# Altium schematic sheet AMS_Slave_Controller.SchDoc: Sheetname
size A4; Date: 05.10.2017; CheckedBy: UNCHECKED; Author: Team Member; Organization: Baltic Racing; Address1: Zur Schwedenschanze 15; Address2: Haus 18; Address3: 18435 Stralsund; Revision: xx.xx; SheetNumber: 1; SheetTotal: 3; Rules: TODO; ProjectName: Projekt
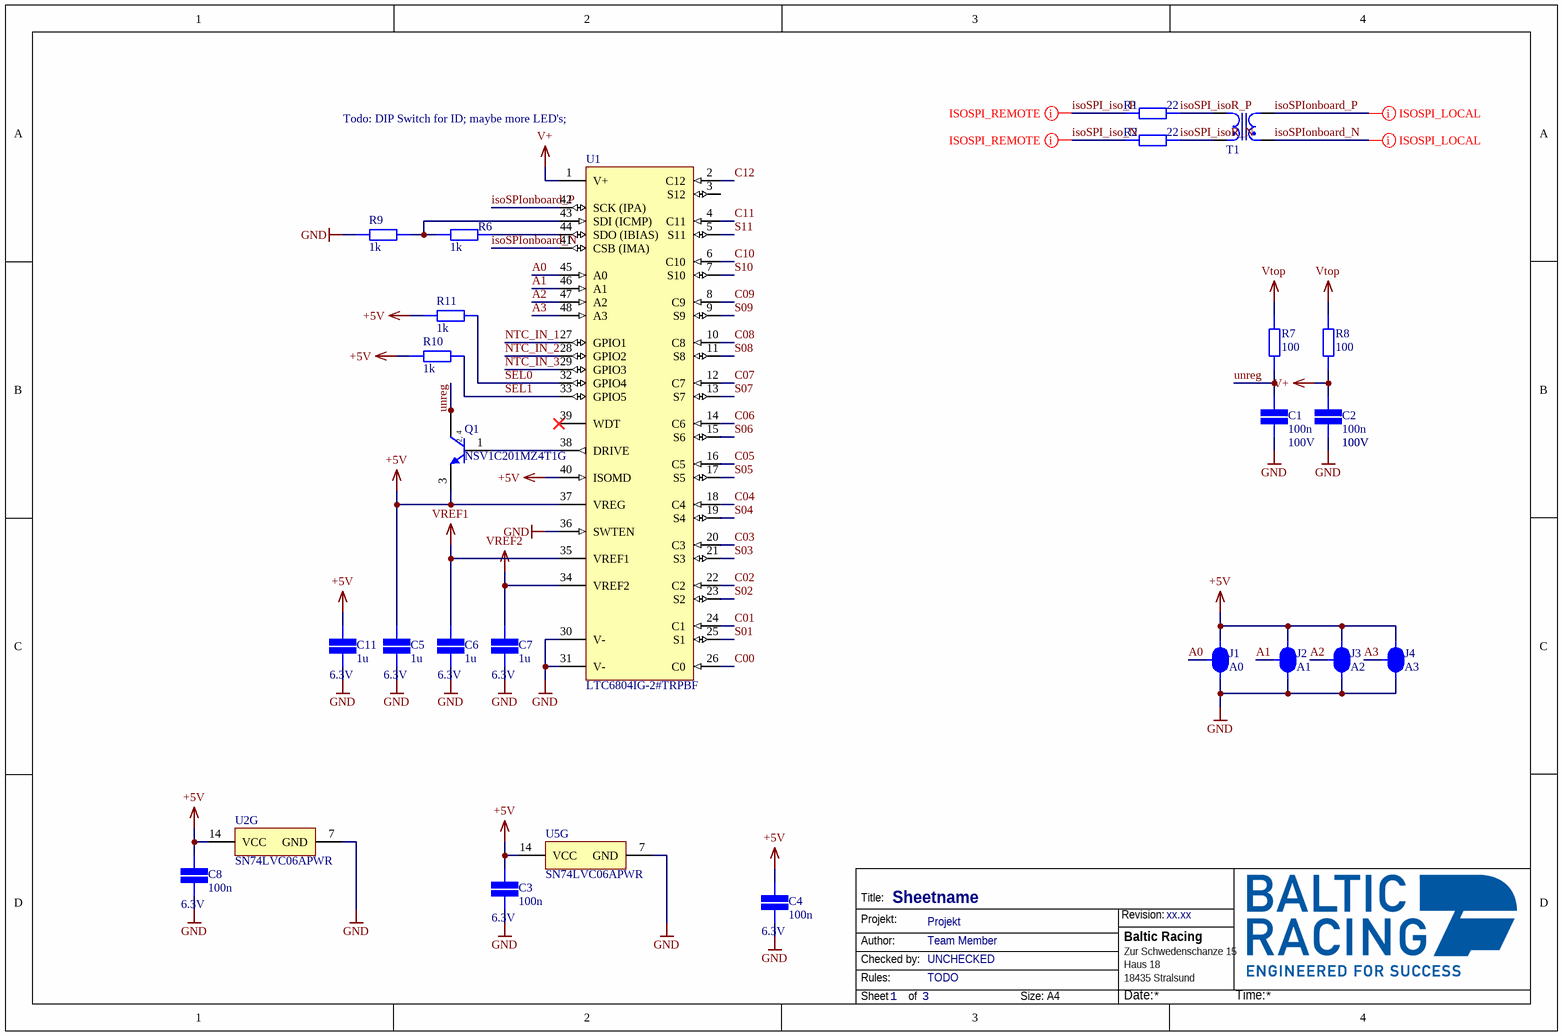
[diagram p0: AMS_Slave_Controller.SchDoc]

## Parts
C1  value 100n  Voltage: 100V  [CAP 0805/2012]  (hidden comment: SMD Capacitor)
C2  value 100n  Voltage: 100V  [CAP 0805/2012]  (hidden comment: SMD Capacitor)
C3  value 100n  Voltage: 6.3V  [CAP 0603/1608]  (hidden comment: SMD Capacitor)
C4  value 100n  Voltage: 6.3V  [CAP 0603/1608]  (hidden comment: SMD Capacitor)
C5  value 1u  Voltage: 6.3V  [CAP 0805/2012]  (hidden comment: SMD Capacitor)
C6  value 1u  Voltage: 6.3V  [CAP 0805/2012]  (hidden comment: SMD Capacitor)
C7  value 1u  Voltage: 6.3V  [CAP 0805/2012]  (hidden comment: SMD Capacitor)
C8  value 100n  Voltage: 6.3V  [CAP 0603/1608]  (hidden comment: SMD Capacitor)
C11  value 1u  Voltage: 6.3V  [CAP 0805/2012]  (hidden comment: SMD Capacitor)
J1  A0  [SMD-JUMPER-3]
J2  A1  [SMD-JUMPER-3]
J3  A2  [SMD-JUMPER-3]
J4  A3  [SMD-JUMPER-3]
Q1  NSV1C201MZ4T1G  [ONSC-SOT-223-4-318E-04_V]
R1  value 22  [STACKPOLE CSR0603]  (hidden comment: SMD Resistor)
R2  value 22  [STACKPOLE CSR0603]  (hidden comment: SMD Resistor)
R6  value 1k  [STACKPOLE CSR0603]  (hidden comment: SMD Resistor)
R7  value 100  [STACKPOLE CSR0603]  (hidden comment: SMD Resistor)
R8  value 100  [STACKPOLE CSR0603]  (hidden comment: SMD Resistor)
R9  value 1k  [STACKPOLE CSR0603]  (hidden comment: SMD Resistor)
R10  value 1k  [STACKPOLE CSR0603]  (hidden comment: SMD Resistor)
R11  value 1k  [STACKPOLE CSR0603]  (hidden comment: SMD Resistor)
T1  750110055  [Wuerth_750110055]  (value not drawn)
U1  LTC6804IG-2#TRPBF  [LT-G-48_M]
U2  SN74LVC06APWR  [PW0014A_M]  (part G of 7)
U5  SN74LVC06APWR  [PW0014A_M]  (part G of 7)

## Nets
+5V: C3.2 C4.2 C5.1 C8.2 C11.1 J1.3 J2.3 J3.3 J4.3 Q1.3(E) R10.1 R11.1 U1.37(VREG) U1.40(ISOMD) U2.14(VCC) U5.14(VCC)
GND: C1.1 C2.1 C3.1 C4.1 C5.2 C6.2 C7.2 C8.1 C11.2 J1.1 J2.1 J3.1 J4.1 R9.2 U1.30(V-) U1.31(V-) U1.36(SWTEN) U2.7(GND) U5.7(GND)
V+: C2.2 R8.1 U1.1(V+)
VREF1: C6.1 U1.35(VREF1)
VREF2: C7.1 U1.34(VREF2)
Vtop: R7.2 R8.2
A0: J1.2 U1.45(A0)
A1: J2.2 U1.46(A1)
A2: J3.2 U1.47(A2)
A3: J4.2 U1.48(A3)
C00: U1.26(C0)
C01: U1.24(C1)
C02: U1.22(C2)
C03: U1.20(C3)
C04: U1.18(C4)
C05: U1.16(C5)
C06: U1.14(C6)
C07: U1.12(C7)
C08: U1.10(C8)
C09: U1.8(C9)
C10: U1.6(C10)
C11: U1.4(C11)
C12: U1.2(C12)
isoSPI_iso_N: R2.1
isoSPI_iso_P: R1.1
isoSPI_isoR_N: R2.2 T1.1
isoSPI_isoR_P: R1.2 T1.2
isoSPIonboard_N: T1.4 U1.41(CSB_(IMA))
isoSPIonboard_P: T1.3 U1.42(SCK_(IPA))
NTC_IN_1: U1.27(GPIO1)
NTC_IN_2: U1.28(GPIO2)
NTC_IN_3: U1.29(GPIO3)
S01: U1.25(S1)
S02: U1.23(S2)
S03: U1.21(S3)
S04: U1.19(S4)
S05: U1.17(S5)
S06: U1.15(S6)
S07: U1.13(S7)
S08: U1.11(S8)
S09: U1.9(S9)
S10: U1.7(S10)
S11: U1.5(S11)
SEL0: R11.2 U1.32(GPIO4)
SEL1: R10.2 U1.33(GPIO5)
unreg: C1.2 Q1.2(C) Q1.4(C) R7.1
NetQ1_1: Q1.1(B) U1.38(DRIVE)
NetR6_1: R6.1 U1.44(SDO_(IBIAS))
NetR6_2: R6.2 R9.1 U1.43(SDI_(ICMP))

Not connected (* = marked no-connect by the designer): U1 3(S12) 39(WDT)*

## Layout directives
differential pair: isoSPI_iso_N, isoSPI_iso_P, isoSPIonboard_N, isoSPIonboard_P

## Notes on the sheet
- Todo: DIP Switch for ID; maybe more LED's;
- (near C2) 100V
- Title:
- Projekt:
- Revision:
- Author:
- Rules:
- Checked by:
- Sheet
- of
- Size:
- A4
- Date:
- Time:
- (in symbol CMP-1048-00450-1) 2, 4

## Library data of the parts
C1-C8 C11 = SMD Capacitor: Capacitor with multiple Footprints
J1-J4 = SMD Jumper 3
Q1 = CMP-1048-00450-1: 100 V, 2 A, Low VCE(sat), NPN Transistor, 4-Pin SOT-223, Pb-Free, Tape and Reel; Manufacturer: On Semiconductor; IC Continuous (A): 2; Note1: 0; PackageReference: SOT-223-4-318E-04; Polarity: NPN; ComponentLink3URL: http://www.onsemi.com/pub_link/Collateral/318E-04.PDF; RoHS: TRUE; PackageDescription: 4-Pin Small Outline Transistor, Body 6.5 x 3.5 mm, Pitch 2.3 mm; DatasheetVersion: Rev. 4; Mounting Technology: Surface Mount; ComponentLink1Description: Manufacturer URL; ComponentLink1URL: http://www.onsemi.com/; PackageVersion: Rev. N, 08/2009; ComponentLink2Description: Datasheet; Packing: Tape and Reel; ComponentLink2URL: http://www.onsemi.cn/pub_link/Collateral/NSS1C201MZ4-D.PDF; ComponentLink3Description: Package Specification; PartNumber: NSV1C201MZ4T1G
R1 R2 R6-R11 = SMD Resistor: Resistor with multiple footprints
T1 = Wuerth_Transformer_750110055: Würth Toroid Transformer 1:1 70µH; Order Nr.: 750312504; Hersteller: Würth
U1 = CMP-0471-00243-1: Multicell Battery Monitor, 60 V Vin MAX, 48-pin SOP (G-48), -40 to 85 degC, Pb-Free, Tape and Reel; Manufacturer: Linear Technology; Vin Max(V): 60; Number of Cells: > 1000 V of stacked Li-Ion cells; Battery Chemistry: Li-Ion, Li-Polymer, NiMH; Type of Charger: Battery Stack Monitor; ComponentLink3Description: Package Specification; RoHS: TRUE; Packing: Tape and Reel; ComponentLink2URL: http://cds.linear.com/docs/en/datasheet/680412f.pdf; Mounting Technology: Surface Mount; PartNumber: LTC6804IG-2#TRPBF; PackageDescription: 48-Pin Plastic SSOP, Body 12.8 x 5.3 mm, Pitch 0.5 mm; PackageReference: G-48; ComponentLink1Description: Manufacturer URL; ComponentLink1URL: http://www.linear.com/; PackageVersion: Rev. Ã˜, 01/2011; ComponentLink3URL: http://cds.linear.com/docs/en/packaging/05081887_0_G48.pdf; ComponentLink2Description: Datasheet
U2 U5 = CMP-1615-01057-2: Hex Inverter Buffers/Drivers With Open-Drain Outputs, PW0014A, LARGE T&R; Manufacturer: Texas Instruments; Technology Family: LVC; Output Drive (IOL/IOH)(Max)(mA): -24/24; VCC(Min)(V): 1.65; Voltage(Nom)(V): 1.8,2.5,2.7,3.3; Schmitt Trigger: No; Rating: Catalog; F @ Nom Voltage(Max)(Mhz): 100; Bits(#): 6; Input Type: CMOS,TTL; ICC @ Nom Voltage(Max)(mA): 0.04; tpd @ Nom Voltage(Max)(ns): 5.6,3.1,3.9,3.7; Output Type: CMOS; VCC(Max)(V): 3.6; PackageReference: PW0014A; Operating Temperature Range(C): -40 to 125; DatasheetVersion: SCAS596N; Generic Part Number: SN74LVC06A; Code_JEDEC: MO-153